# Altium schematic sheet [01]-SensorAndActuator.SchDoc
size A; DrawnBy: Trong Nhan; SheetNumber: 1; SheetTotal: 2
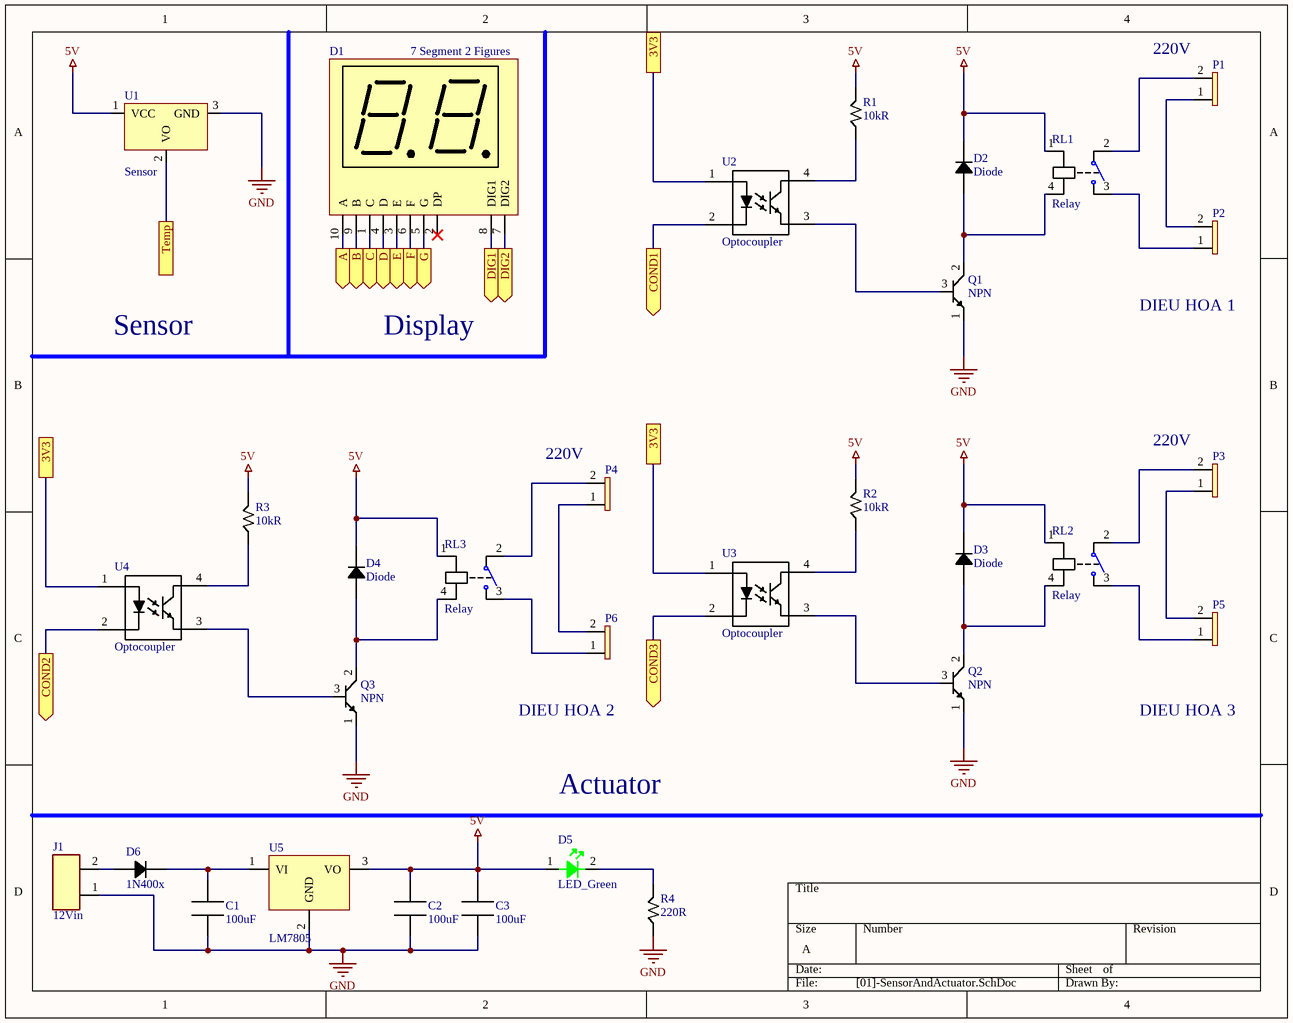
[diagram p0: [01]-SensorAndActuator.SchDoc]

## Parts
C1  100uF  [CAPC0805]
C2  100uF  [CAPC0805]
C3  100uF  [CAPC0805]
D1  7 Segment 2 Figures  [5621BS]
D2  Diode  [10A10]
D3  Diode  [10A10]
D4  Diode  [10A10]
D5  LED_Green  [LED SMD 0805]
D6  1N400x  [1N400x]
J1  12Vin  [domino_2_pin]
P1  Header 1*2 Pins  [HDR_M_2_PINS_2.54]  (value not drawn)
P2  Header 1*2 Pins  [HDR_M_2_PINS_2.54]  (value not drawn)
P3  Header 1*2 Pins  [HDR_M_2_PINS_2.54]  (value not drawn)
P4  Header 1*2 Pins  [HDR_M_2_PINS_2.54]  (value not drawn)
P5  Header 1*2 Pins  [HDR_M_2_PINS_2.54]  (value not drawn)
P6  Header 1*2 Pins  [HDR_M_2_PINS_2.54]  (value not drawn)
Q1  NPN  [to-92]
Q2  NPN  [to-92]
Q3  NPN  [to-92]
R1  10kR  [RESC0805]
R2  10kR  [RESC0805]
R3  10kR  [RESC0805]
R4  220R  [RESC0805]
RL1  Relay  [Relay G5NB]
RL2  Relay  [Relay G5NB]
RL3  Relay  [Relay G5NB]
U1  Sensor  [to-92]
U2  Optocoupler  [DIP 4]
U3  Optocoupler  [DIP 4]
U4  Optocoupler  [DIP 4]
U5  LM7805  [LM7805]

## Ports
3V3, A (out), B (out), C (out), COND1 (out), COND2 (out), COND3 (out), D (out), DIG1 (out), DIG2 (out), E (out), F (out), G (out), Temp

## Nets
5V: C2.2 C3.2 D2.2 D3.2 D4.2 D5.1 R1.2 R2.2 R3.2 RL1.1 RL2.1 RL3.1 U1.1(VCC) U5.3(VO)
GND: C1.1 C2.1 C3.1 J1.1 Q1.1(Emitter) Q2.1(Emitter) Q3.1(Emitter) R4.1 U1.3(GND) U5.2(GND)
3V3: U2.1(Anode) U3.1(Anode) U4.1(Anode) ; port 3V3
A: D1.10(A) ; port A
B: D1.9(B) ; port B
C: D1.1(C) ; port C
COND1: U2.2(Cathode) ; port COND1
COND2: U4.2(Cathode) ; port COND2
COND3: U3.2(Cathode) ; port COND3
D: D1.4(D) ; port D
DIG1: D1.8(DIG1) ; port DIG1
DIG2: D1.7(DIG2) ; port DIG2
E: D1.3(E) ; port E
F: D1.6(F) ; port F
G: D1.5(G) ; port G
Temp: U1.2(VO) ; port Temp
NetC1_2: C1.2 D6.2 U5.1(VI)
NetD2_1: D2.1 Q1.2(Collector) RL1.4
NetD3_1: D3.1 Q2.2(Collector) RL2.4
NetD4_1: D4.1 Q3.2(Collector) RL3.4
NetD5_2: D5.2 R4.2
NetD6_1: D6.1 J1.2
NetP1_1: P1.1 P2.2
NetP1_2: P1.2 RL1.2
NetP2_1: P2.1 RL1.3
NetP3_1: P3.1 P5.2
NetP3_2: P3.2 RL2.2
NetP4_1: P4.1 P6.2
NetP4_2: P4.2 RL3.2
NetP5_1: P5.1 RL2.3
NetP6_1: P6.1 RL3.3
NetQ1_3: Q1.3(Base) U2.3(Emitter)
NetQ2_3: Q2.3(Base) U3.3(Emitter)
NetQ3_3: Q3.3(Base) U4.3(Emitter)
NetR1_1: R1.1 U2.4(Collector)
NetR2_1: R2.1 U3.4(Collector)
NetR3_1: R3.1 U4.4(Collector)

Not connected (* = marked no-connect by the designer): D1 2(DP)*

## Notes on the sheet
- (near P1) 220V
- Sensor
- Display
- (near P2) DIEU HOA 1
- (near P4) 220V
- (near P3) 220V
- (near P6) DIEU HOA 2
- DIEU HOA 3
- Actuator

## Library data of the parts
C1-C3 = Capacitor Non Polar: Capacitor_Non_Polar
D2-D4 = 10A10: Diode 10A
D6 = Diode 1N4007: 1A - 1kV
J1 = Domino 2 Pin: 2 Pins, 5.08mm
P1-P6 = Header 1x2 Pins
Q1-Q3 = 2SC1815: Transistor NPN
R1-R4 = Resistor: Resistor_TH_1/4W
RL1-RL3 = Relay G5NB: 4 Pins
U1 = LM35: Temperature sensor
U2-U4 = Optocoupler: Opto
U5 = LM7805: 5V, 1A